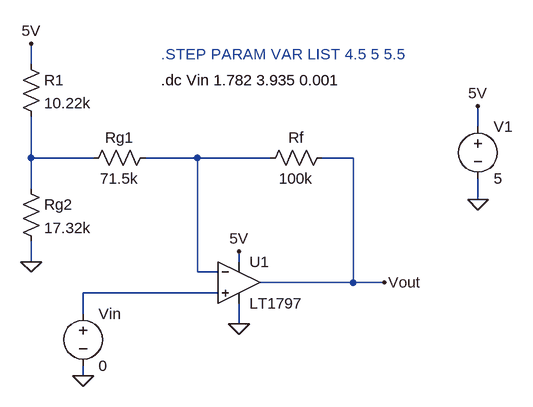
[diagram p0: schematic LT1797 Gain & Offset.asc]
LT1797 Gain & Offset.asc, the LTspice schematic file:
Version 4
SHEET 1 880 680
WIRE 32 96 32 64
WIRE 720 192 720 160
WIRE 32 240 32 176
WIRE 128 240 32 240
WIRE 288 240 208 240
WIRE 400 240 288 240
WIRE 528 240 480 240
WIRE 32 288 32 240
WIRE 720 304 720 272
WIRE 32 400 32 368
WIRE 352 400 352 384
WIRE 288 416 288 240
WIRE 320 416 288 416
WIRE 528 432 528 240
WIRE 528 432 384 432
WIRE 576 432 528 432
WIRE 320 448 112 448
WIRE 112 480 112 448
WIRE 352 496 352 464
WIRE 112 576 112 560
FLAG 32 400 0
FLAG 352 496 0
FLAG 720 160 5V
FLAG 720 304 0
FLAG 352 384 5V
FLAG 32 64 5V
FLAG 576 432 Vout
FLAG 112 576 0
SYMBOL OpAmps/LT1797 352 368 R0
SYMATTR InstName U1
SYMBOL res 16 80 R0
SYMATTR InstName R1
SYMATTR Value 10.22k
SYMBOL res 16 272 R0
SYMATTR InstName Rg2
SYMATTR Value 17.32k
SYMBOL res 112 256 R270
WINDOW 0 32 56 VTop 2
WINDOW 3 0 56 VBottom 2
SYMATTR InstName Rg1
SYMATTR Value 71.5k
SYMBOL res 384 256 R270
WINDOW 0 32 56 VTop 2
WINDOW 3 0 56 VBottom 2
SYMATTR InstName Rf
SYMATTR Value 100k
SYMBOL voltage 720 176 R0
SYMATTR InstName V1
SYMATTR Value 5
SYMBOL voltage 112 464 R0
SYMATTR InstName Vin
SYMATTR Value 0
TEXT 232 120 Left 2 !.dc Vin 1.782 3.935 0.001
TEXT 232 80 Left 2 ;.STEP PARAM VAR LIST 4.5 5 5.5

The netlist it stands for:
* LT1797 Gain & Offset.asc
XU1 N003 N002 5V 0 Vout LT1797  ; pins In+ In- V+ V- OUT
R1 5V N001 10.22k
Rg2 N001 0 17.32k
Rg1 N001 N002 71.5k
Rf N002 Vout 100k
V1 5V 0 5
Vin N003 0 0
.dc Vin 1.782 3.935 0.001
* .STEP PARAM VAR LIST 4.5 5 5.5
.backanno
.end